# EAGLE design bq40z50 (EAGLE 9.4.2)
CNAME: CLEVO N85x Fuel Gauge Board; CREVISION: V1; DESIGNER: µgurkrcl
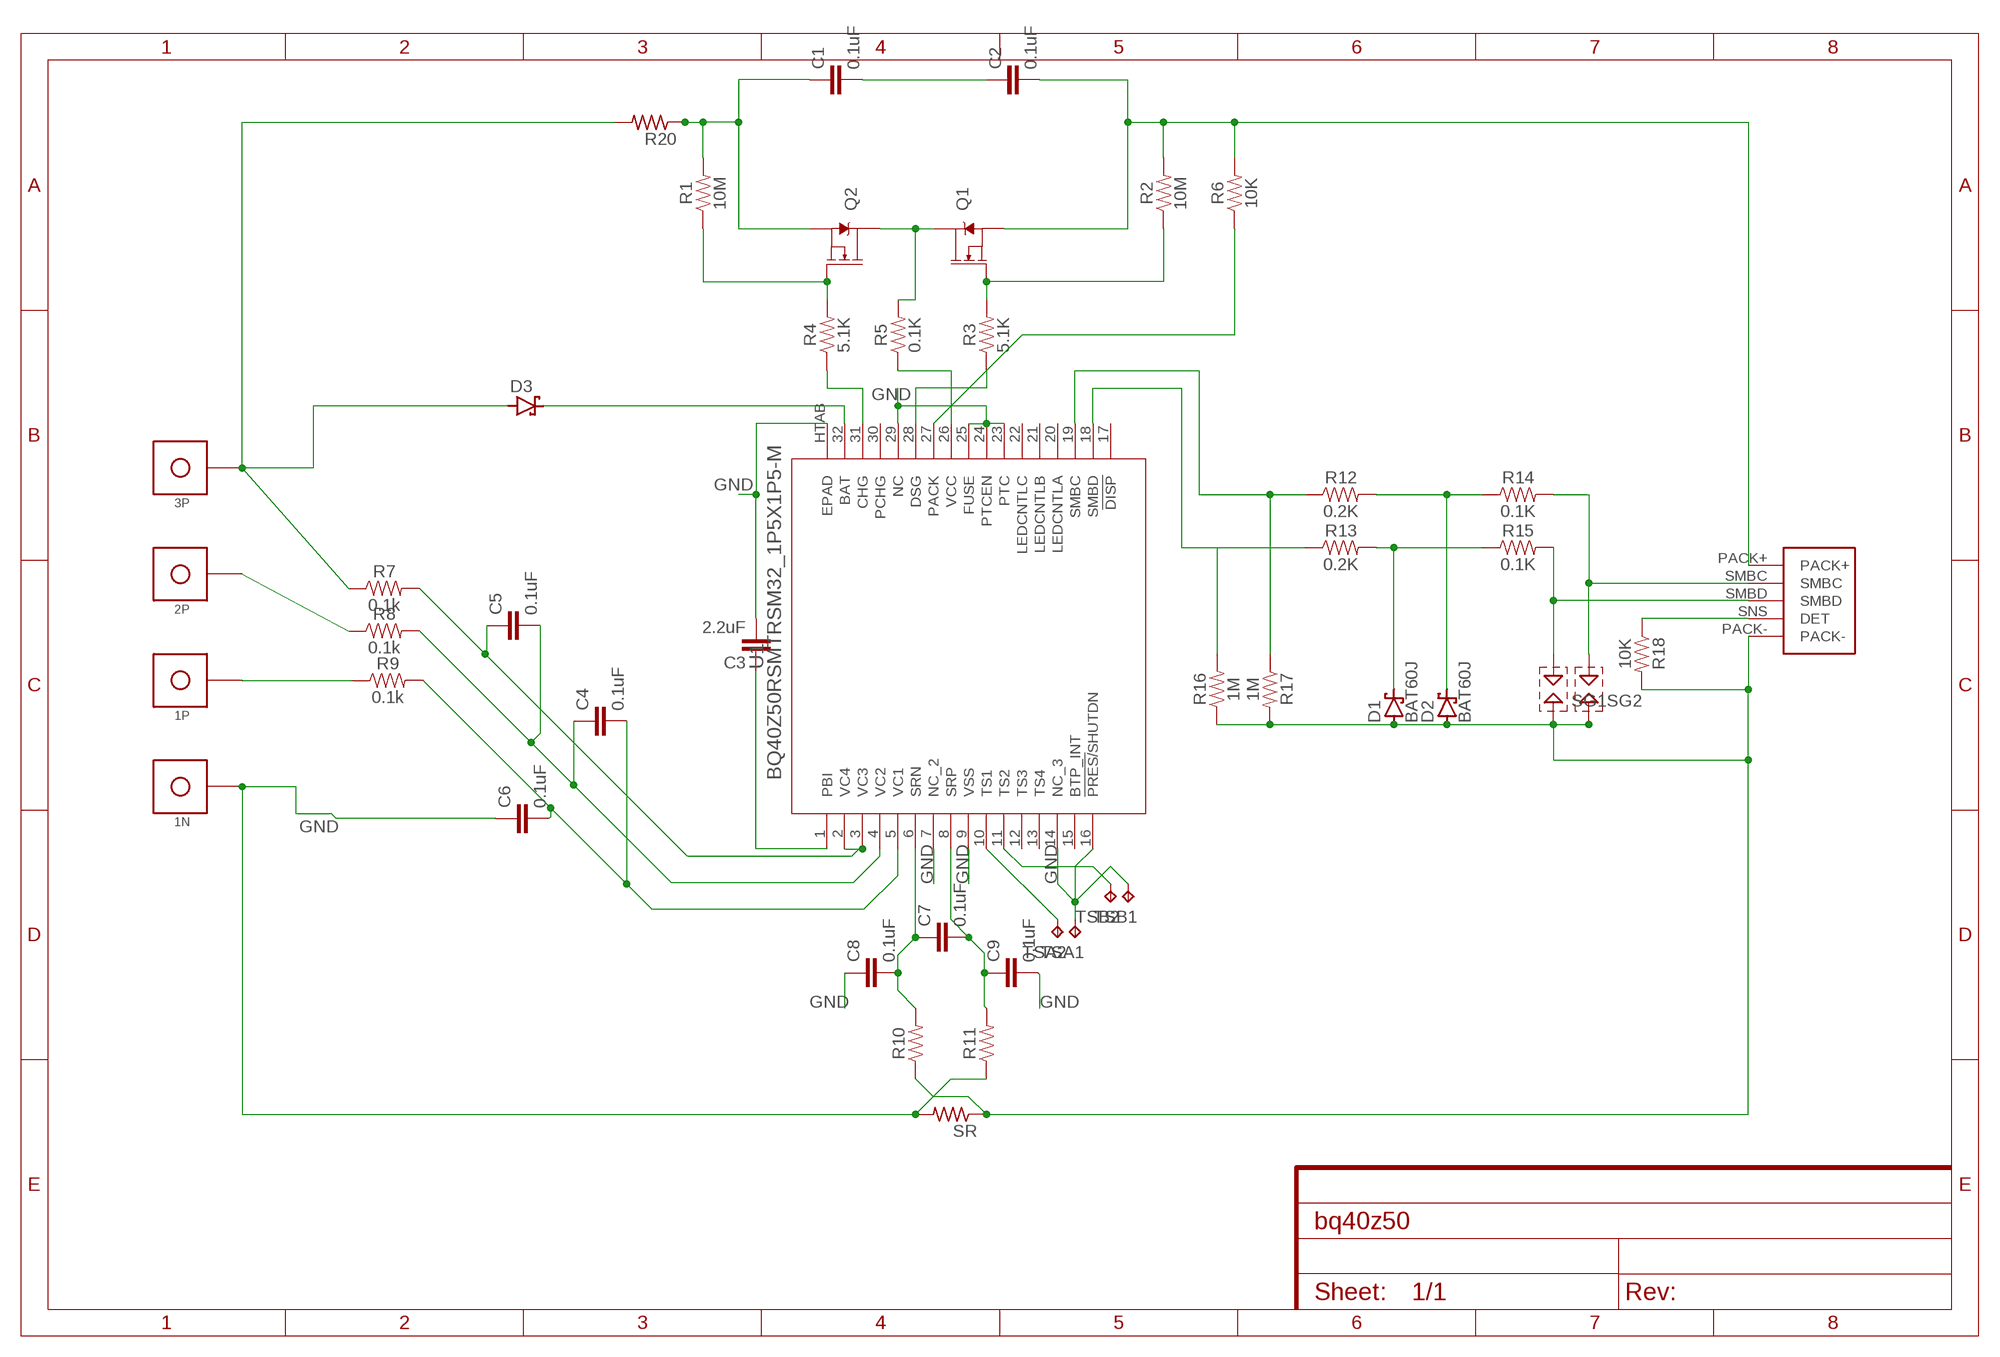
[diagram p0: schematic, sheet 1]

## Parts
1N  BAT_TAB  [BATT_TAB]
1P  BAT_TAB  [BATT_TAB]
2P  BAT_TAB  [BATT_TAB]
3P  BAT_TAB  [BATT_TAB]
C1  0.1uF  0.1UF-0402-16V-10%  [0402]
C2  0.1uF  0.1UF-0402-16V-10%  [0402]
C3  2.2uF  0.1UF-0402-16V-10%  [0402]
C4  0.1uF  0.1UF-0402-16V-10%  [0402]
C5  0.1uF  0.1UF-0402-16V-10%  [0402]
C6  0.1uF  0.1UF-0402-16V-10%  [0402]
C7  0.1uF  0.1UF-0402-16V-10%  [0402]
C8  0.1uF  0.1UF-0402-16V-10%  [0402]
C9  0.1uF  0.1UF-0402-16V-10%  [0402]
D1  BAT60J  [SOD323_ST]
D2  BAT60J  [SOD323_ST]
D3  BAT60J  [SOD323_ST]
Q1  6.5A/30V/38mΩ  MOSFET-NCH-FDS6630A  [SO08]
Q2  6.5A/30V/38mΩ  MOSFET-NCH-FDS6630A  [SO08]
R1  10M  RESISTOR0402  [0402]
R2  10M  RESISTOR0402  [0402]
R3  5.1K  RESISTOR0402  [0402]
R4  5.1K  RESISTOR0402  [0402]
R5  0.1K  RESISTOR0402  [0402]
R6  10K  RESISTOR0402  [0402]
R7  0.1k  RESISTOR0402  [0402]
R8  0.1k  RESISTOR0402  [0402]
R9  0.1k  RESISTOR0402  [0402]
R10  RESISTOR0402  [0402]
R11  RESISTOR0402  [0402]
R12  0.2K  RESISTOR0402  [0402]
R13  0.2K  RESISTOR0402  [0402]
R14  0.1K  RESISTOR0402  [0402]
R15  0.1K  RESISTOR0402  [0402]
R16  1M  RESISTOR0402  [0402]
R17  1M  RESISTOR0402  [0402]
R18  10K  RESISTOR0402  [0402]
R20  R-US_R2512  [R2512]
SG1  SPARK-GAP-8  [SPARK-GAP-8]
SG2  SPARK-GAP-8  [SPARK-GAP-8]
SR  R-US_R2512  [R2512]
TSA1  TPTP18R  [TP18R]
TSA2  TPTP18R  [TP18R]
TSB1  TPTP18R  [TP18R]
TSB2  TPTP18R  [TP18R]
U1  BQ40Z50RSMTRSM32_1P5X1P5-M  [RSM32_1P5X1P5-M]
U$1  N857HK1_FG  [N850BAT]

## Nets
GND: 1N.P$1 C3.2 C6.1 C8.1 C9.2 R11.1 SR.2 TSA1.TP TSB1.TP U1.7(NC_2) U1.9(VSS) U1.14(NC_3) U1.16(!PRES/!SHUTDN) U1.23(PTC) U1.24(PTCEN) U1.25(FUSE) U1.29(NC) U1.HTAB(EPAD)
N$1: Q2.4(G) R1.1 R4.2
N$2: 3P.P$1 D3.A R7.1 R20.2
N$3: D1.A D2.A R10.1 R16.1 R17.2 R18.2 SG1.2 SG2.2 SR.1 U$1.PACK-
N$4: C1.1 Q2.1(S) Q2.2(S) Q2.3(S) R1.2 R20.1
N$5: C1.2 C2.1
N$6: C2.2 Q1.1(S) Q1.2(S) Q1.3(S) R2.2 R6.2 U$1.PACK+
N$7: Q1.5(D) Q1.6(D) Q1.7(D) Q1.8(D) Q2.5(D) Q2.6(D) Q2.7(D) Q2.8(D) R5.2
N$8: Q1.4(G) R2.1 R3.2
N$9: R4.1 U1.31(CHG)
N$10: R3.1 U1.28(DSG)
N$11: R5.1 U1.26(VCC)
N$12: R6.1 U1.27(PACK)
N$13: D3.C U1.32(BAT)
N$14: C3.1 U1.1(PBI)
N$15: C5.1 R7.2 U1.2(VC4) U1.3(VC3)
N$16: 2P.P$1 R8.1
N$17: 1P.P$1 R9.1
N$18: C7.2 C9.1 R11.2 U1.8(SRP)
N$19: C4.1 C5.2 R8.2 U1.4(VC2)
N$20: C4.2 C6.2 R9.2 U1.5(VC1)
N$21: C7.1 C8.2 R10.2 U1.6(SRN)
N$22: TSA2.TP U1.10(TS1)
N$23: TSB2.TP U1.11(TS2)
N$24: R13.1 R16.2 U1.18(SMBD)
N$25: R12.1 R17.1 U1.19(SMBC)
N$26: D1.C R13.2 R15.1
N$27: D2.C R12.2 R14.1
N$28: R15.2 SG1.1 U$1.SMBD
N$29: R14.2 SG2.1 U$1.SMBC
N$30: R18.1 U$1.SNS(DET)
Unconnected: U1.12(TS3) U1.13(TS4) U1.15(BTP_INT) U1.17(!DISP) U1.20(LEDCNTLA) U1.21(LEDCNTLB) U1.22(LEDCNTLC) U1.30(PCHG)

## Library data of the parts
1N 1P 2P 3P = ugurkrcl:BAT_TAB
C1 C2 C4-C9 = SparkFun-Capacitors:0.1UF: 0.1µF ceramic capacitors A capacitor is a passive two-terminal electrical component used to store electrical energy temporarily in an electric field.; PROD_ID: CAP-12416
C3 = SparkFun-Capacitors:0.1UF: 0.1µF ceramic capacitors A capacitor is a passive two-terminal electrical component used to store electrical energy temporarily in an electric field.; PROD_ID: CAP-12416; VALUE: 0.1uF
D1-D3 = diode:BAT60J: Schottky barrier diode Source: www.st.com, BAT60J.pdf
Q1 Q2 = SparkFun-DiscreteSemi:MOSFET-NCH: N-channel MOSFETs Voltage controlled devices that allow control of high current outputs. SparkFun Products: SparkFun OpenScale <https://www.sparkfun.com/products/13261> SparkFun Digital Sandbox <https://www.sparkfun.com/products/12651> SparkFun Monster Moto Shield <https://www.sparkfun.com/products/10182> SparkFun MOSFET Power Controller <https://www.sparkfun.com/products/11214>; PROD_ID: TRANS-08089
R1-R18 = SparkFun-Resistors:RESISTOR: Generic Resistor Package
R20 SR = resistor:R-US_: RESISTOR, American symbol
SG1 SG2 = supressor:SPARK-GAP-: SPARK GAP
TSA1 TSA2 TSB1 TSB2 = testpad:TP: Test pad
U1 = Fuel Gauge:BQ40Z50RSMT; MANUFACTURER_PART_NUMBER: BQ40Z50RSMT; VENDOR: Texas Instruments
U$1 = ugurkrcl:N857HK1_FG

## Board
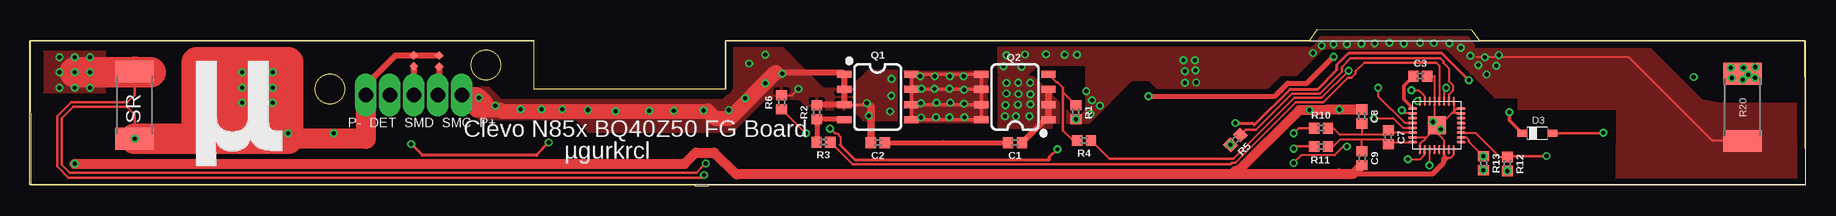
[diagram p1: board, top side]
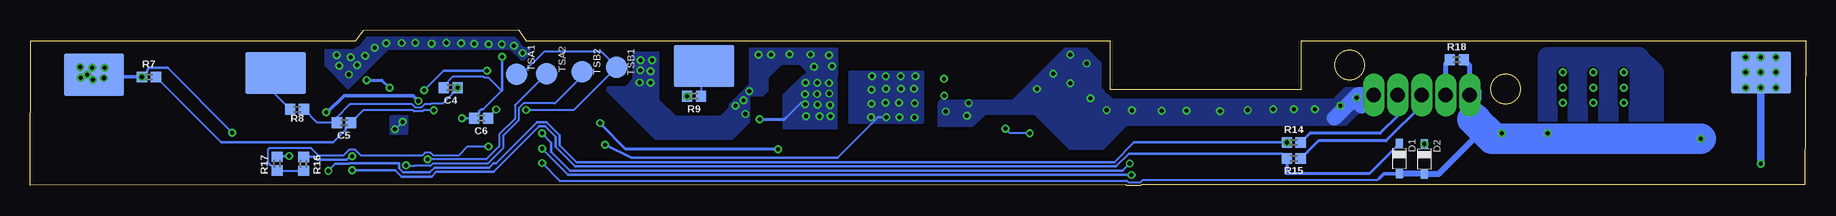
[diagram p2: board, bottom side, seen from below]

Size 148.01 x 12.98 mm. Coordinates in mm from the lower left corner, seen from the top.
Outline: 0.07,0.06 55.35,0.07 55.45,0 56.58,0 56.65,0.07 148.01,0.05 147.95,12.09 120.86,12.07 120.18,12.98 107.27,12.98 106.66,12.08 57.98,12.06 57.98,8.05 42.01,8.05 42.01,12.08 0,12.08 0.07,0.06
Outline: circle at 24.99,8.05 radius 1.24
Outline: circle at 37.99,10.06 radius 1.24
Copper layers (1*16): Top 0.035mm / dielectric 1.6mm / Bottom 0.035mm
Design rules "Elecrow_2-layer_PCB_eagle_rule": minimum track width 6mil, minimum drill 12mil, track to track 6mil, track to pad 8mil, pad to pad 12mil, via to via 12mil, smd to smd 0mil, copper to edge 20mil, drill to drill 10mil, minimum pad ring 6mil, minimum via ring 6mil, stop-mask expansion 0mil, vias tented up to drill 100mil, thermal gap 10mil

### Footprints (pad centres in the part's own frame; a part is rotated, then mirrored left to right if it is on the bottom)
BATT_TAB = smd 5 x 3.5: P$1 0,0
0402 = smd 0.85 x 0.9: 1 -0.58,0; 2 0.58,0
SOD323_ST = smd 0.8 x 0.6: A 1.25,0; C -1.25,0
SO08 = smd 0.6 x 1.2: 1 -1.905,-2.8; 2 -0.635,-2.8; 3 0.635,-2.8; 4 1.905,-2.8; 5 1.905,2.8; 6 0.635,2.8; 7 -0.635,2.8; 8 -1.905,2.8
R2512 = smd 1.8 x 3.2: 1 -2.8,0; 2 2.8,0
SPARK-GAP-8 = smd 0.508 x 0.508 rotated 45: 1 -0.457,0; 2 0.457,0
TP18R = smd 1.8 x 1.8: TP 0,0
RSM32_1P5X1P5-M = smd 0.2 x 0.75: 1 1.4,2.019; 2 1,2.019; 3 0.6,2.019; 4 0.2,2.019; 5 -0.2,2.019; 6 -0.6,2.019; 7 -1,2.019; 8 -1.4,2.019; 17 -1.4,-2.019; 18 -1,-2.019; 19 -0.6,-2.019; 20 -0.2,-2.019; 21 0.2,-2.019; 22 0.6,-2.019; 23 1,-2.019; 24 1.4,-2.019 | smd 0.75 x 0.2: 9 -2.019,1.4; 10 -2.019,1; 11 -2.019,0.6; 12 -2.019,0.2; 13 -2.019,-0.2; 14 -2.019,-0.6; 15 -2.019,-1; 16 -2.019,-1.4; 25 2.019,-1.4; 26 2.019,-1; 27 2.019,-0.6; 28 2.019,-0.2; 29 2.019,0.2; 30 2.019,0.6; 31 2.019,1; 32 2.019,1.4 | smd 1.5 x 1.5: HTAB 0,0
N850BAT = drill 1.2 pad 1.65 long: PACK+ 36.006,7.127; PACK- 28.006,7.127; SMBC 34.006,7.127; SMBD 32.006,7.127; SNS 30.006,7.127

### Placement (x,y rotation side)
1N  3.73,9.45 0 bottom
1P  91.82,9.97 0 bottom
2P  127.53,9.39 180 bottom
3P  142.68,9.25 0 bottom
C1  82.1,3.58 180 top
C2  70.67,3.58 180 top
C3  115.88,9.12 0 top
C4  112.95,8.18 180 bottom
C5  121.84,5.26 180 bottom
C6  110.41,5.64 180 bottom
C7  113.23,4.04 270 top
C8  111.02,5.77 270 top
C9  111.03,2.29 270 top
D1  33.85,2.25 270 bottom
D2  31.77,2.23 270 bottom
D3  125.65,4.37 0 top
Q1  70.67,7.39 270 top
Q2  82.1,7.39 90 top
R1  87.18,6.12 270 top
R2  65.59,6.12 90 top
R3  66.14,3.64 180 top
R4  87.87,3.77 180 top
R5  100.48,3.82 225 top
R6  62.66,6.95 90 top
R7  138.09,9.06 0 bottom
R8  125.75,6.36 0 bottom
R9  92.65,7.46 180 bottom
R10  107.62,4.8 0 top
R11  107.62,3.27 0 top
R12  123.13,1.82 270 top
R13  121.15,1.87 270 top
R14  42.66,3.61 0 bottom
R15  42.66,2.27 0 bottom
R16  125.21,1.82 90 bottom
R17  127.41,1.84 270 bottom
R18  29.08,10.5 0 bottom
R20  142.75,6.54 90 top
SG1  32,10.41 90 top
SG2  34.11,10.39 90 top
SR  8.72,6.71 90 top
TSA1  107.43,9.28 0 bottom
TSA2  104.96,9.35 0 bottom
TSB1  99.09,9.89 0 bottom
TSB2  101.99,9.5 0 bottom
U1  117.27,5.03 90 top
U$1  -0.01,0.45 0 top

### Tracks (layer width: path | path; a pad name or v marks a point on that pad's centre or on a via)
GND  (via drill 0.35)
  Top 0.152: v5,9.45 5,9.51 SR.2 | 117.27,4.89 116.4,4.03 | 116.4,4.03 116.09,3.71 116.07,3.71 115.87,3.51 U1.9 | U1.14 117.85,2.99 117.85,2.38 | 117.85,2.22 117.85,2.38 | 109.14,1.01 110.41,1.01 | 117.27,4.78 117.27,4.41 117.89,3.79 117.89,2.56 118.1,2.35 | 118.65,2.56 118.65,2.99 U1.16 118.67,2.58 118.44,2.35 118.27,2.35 | U1.23 118.52,6.03 | 118.52,6.03 117.42,4.93 | U1.24 118.92,6.43 118.67,6.18 | 117.42,4.93 117.27,4.78 | U1.29 117.07,5.29 117.27,5.09 | 117.27,5.09 117.42,4.93 | U1.7 116.4,4.03 | 118.27,2.35 118.1,2.35 | 117.85,1.93 117.89,1.97 | 117.89,1.97 118.27,2.35 | 118.1,2.35 118.06,2.35 | 118.06,2.35 117.88,2.35 117.85,2.38 | 117.89,1.97 117.89,2.18 118.06,2.35 | v117.59,4.71 U1.HTAB | U1.HTAB 117.27,5.09 | 117.27,4.89 117.27,4.78 | U1.HTAB 117.27,4.89 | U1.25 118.67,6.18 | 118.67,6.18 118.52,6.03 | 55.8,0.68 55.98,0.68
  Top 0.165: C3.2 117.07,9.13 U1.29
  Top 0.203: SR.2 8.72,7.55 8.11,6.94 3.43,6.94 2.28,5.79 2.28,1.61 3.21,0.68 4.34,0.68 55.8,0.68 | 55.98,0.68 v56.19,0.9 | v105.33,3.1 105.51,3.27 R11.1
  Top 0.406: 117.85,2.22 117.85,1.93 116.93,1.01 110.41,1.01
  Top 0.813: v3.73,1.83 54.56,1.83 55.5,2.76 57.04,2.76 58.79,1.01 | 58.79,1.01 58.82,0.98 58.98,0.98 | 58.79,1.01 100.25,1.01 | 100.25,1.01 109.14,1.01 110.33,1.01 C9.2 | 100.25,1.01 100.48,1.24 100.74,1.24 105.81,6.31 v106.64,6.31 108.07,6.31 108.11,6.35 v109.14,6.35 C8.1
  Top 2.54: v5,9.45 10.08,9.45 | SR.2 8.72,9.45 1N.P$1
  Bottom 0.152: 1N.P$1 v3.73,10.72 v2.46,10.72 | v106.64,6.31 102.67,6.31 TSB1.TP 100.36,11.16 105.17,11.16 107.05,9.28 TSA1.TP | v116.94,5.32 117.55,4.71 v117.59,4.71
  Bottom 0.203: v56.19,0.9 103.13,0.9 v105.33,3.1 | C6.1 109.83,5.66 v109.14,6.35
  Bottom 0.61: 1N.P$1 v3.73,1.83
  other vias: 3.73,9.45 5,10.72 2.46,9.45 2.46,8.18 3.73,8.18 5,8.18
  pour Top: 1.19,11.23 6.27,11.23 6.27,7.7 1.19,7.7
  pour Bottom (no thermals): 116.51,5.77 117.96,5.77 117.97,5.76 117.97,4.34 117.96,4.34 116.56,4.34 116.56,4.34 116.51,4.39
N$1
  Top 0.203: Q2.4 85.57,8.63 85.63,8.63 86.11,8.15 | 86.11,8.15 86.11,4.6 86.94,3.77 R4.2 | R1.1 86.11,7.77 86.11,8.15
N$2  (via drill 0.35)
  Top 0.152: R20.2 142.83,9.41 v142.83,9.84 | R20.2 142.64,9.45 142.16,9.45 v141.77,9.83 | R20.2 142.2,9.34 v141.85,8.98 | R20.2 v142.75,8.84 v142.76,8.83 | v143.79,8.99 143.44,9.34 143.26,9.34 | 143.26,9.34 v143.82,9.89 | R20.2 143.26,9.34 | R20.2 143.15,9.34 v143.24,9.25
  Top 0.203: D3.A 131.1,4.37 v131.15,4.42
  Bottom 0.203: 138.7,9.06 138.24,9.51 138.24,9.64 138.07,9.82 136.55,9.82 v131.15,4.42
  Bottom 0.305: R7.1 138.7,9.06 143.04,9.06 v143.24,9.25 | 143.43,9.45 v143.24,9.25 | v143.24,9.25 3P.P$1
  other vias: 138.67,9.06
N$3  (via drill 0.35)
  Top 0.152: v109.77,3.27 109.47,3.27 108.74,2.54 | 108.73,2.54 108.74,2.54 | v105.33,1.9 105.98,2.54 108.74,2.54
  Top 0.203: SR.1 8.72,5.91 8.04,6.59 3.61,6.59 2.66,5.64 2.66,1.74 3.31,1.08 55.56,1.08 55.95,1.48 55.96,1.48 v56.34,1.86 | v105.33,4.37 105.76,4.8 R10.1
  Top 0.508: U$1.PACK- 28.64,8.22 28.64,9.04 30.48,10.87 SG1.2 34.08,10.87 SG2.2
  Top 1.651: U$1.PACK- 28,3.91 SR.1 | 17.7,3.92 15.16,3.92 v15.16,6.91 v15.16,8.18 v15.16,9.45 v17.7,9.45 v20.24,9.45 v20.24,8.18 v20.24,6.91 20.24,5.64 16.43,5.64 16.43,8.18 v17.7,8.18 18.97,8.18 18.97,6.91 v17.7,6.91
  Top 2.54: SR.1 13.89,3.91 13.89,10.3 21.51,10.3 v21.51,4.37 21.51,3.92 17.7,3.92 SR.1
  Bottom 0.152: R16.1 125.23,1.26 R17.2 127.86,1.72 127.97,1.72 128.19,1.94 128.19,3.01 128.07,3.13 124.55,3.13 123.92,2.5 121.9,2.5 121.38,3.01 120.92,3.01 120.41,2.5 115.34,2.5 115.08,2.76 114.62,2.76 114.36,2.5 112.29,2.5 111.52,3.27 v109.77,3.27 | v105.33,1.9 103.86,0.43 56.58,0.43 56.43,0.28 55.45,0.28 55.25,0.49 35.69,0.49 35.55,0.63 | 33.55,0.98 33.83,0.98
  Bottom 0.203: v56.34,1.86 56.93,1.27 56.93,1.26 102.99,1.26 104.56,2.83 104.56,3.6 v105.33,4.37 | 27.77,5.55
  Bottom 0.254: 28,8.45 27.63,8.45 27.11,7.93 27.11,7.2 27.64,6.68 | 27.86,6.31 27.86,6.46 27.64,6.68 | U$1.PACK- 28,7.05 27.64,6.68
  Bottom 0.305: 35.55,0.63 35.16,1.01 33.55,0.98
  Bottom 0.406: U$1.PACK- 28,8.45 28,10.01 R18.2
  Bottom 0.508: 33.55,0.98 D2.A 30.57,0.98 27.18,4.37 v25.32,4.37 | 33.83,0.98 D1.A
  Bottom 1.016: 24.86,3.91 v25.32,4.37 27.26,6.31 27.86,6.31
  Bottom 1.651: U$1.PACK- 28,6.6 27.86,6.46
  Bottom 2.54: SR.1 24.86,3.91 26.13,3.91 27.77,5.55 | 27.77,5.55 27.48,5.55
  other vias: 8.72,3.91
N$4  (via drill 0.35)
  Top 0.152: R20.1 140.25,3.74 133.27,10.72 120.57,10.72
  Top 0.406: 84.87,5.77 C1.1
  Top 0.508: 84.87,5.77 84.87,8 Q2.3 Q2.1 84.58,5.49 C1.1
  Bottom 0.203: 85.01,5.64 83.74,6.91 83.51,6.91 v83.39,6.79
  Bottom 0.254: R1.2 85.1,5.54 85.01,5.64
  other vias: 81.41,8.56 82.38,8.59 83.37,8.58 83.4,7.63 82.4,7.65 81.38,7.69 81.32,6.72 82.35,6.76 83.31,5.8 82.18,5.78 81.28,5.78 87.18,5.54 106.93,11.06 107.66,11.66 108.67,11.79 109.78,11.8 110.98,11.84 112.08,11.87 113.3,11.93 114.53,11.85 115.88,11.92 117.02,11.89 118.31,11.87 119.27,11.5 120.06,10.84 120.73,10.05 121.42,9.27 122.23,10 122.44,10.89 121.27,10.72 81.15,9.95 82.66,9.91 81.39,10.88 82.93,10.93 84.7,10.96 86.24,10.91 87.28,10.92 88.04,7.87 88.53,7.13 88.39,5.98 89.2,6.66 96.14,10.47 97.1,10.46 96.28,9.53 96.27,8.58 97.14,9.61 97.2,8.61
  pour Top (no thermals): 85.12,8.06 85.12,4.82 80.8,4.82 80.8,9.1 83.46,9.1 84.5,8.06 85.12,8.06
  pour Bottom (no thermals): 83.48,9.22 85.17,7.52 85.17,4.81 80.77,4.81 80.76,4.81 80.76,9.11 80.78,9.13 83.4,9.13 83.47,9.21
  pour Top (no thermals): 140.89,6.91 147.24,6.91 147.26,0.6 132.25,0.62 132.28,6.31 124.07,6.31 124.07,7.29 122.13,7.29 117.97,11.45 135.05,11.45 139.31,7.2
  pour Top (no thermals): 120.37,10.68 118.84,10.68 118.11,11.41 107.76,11.41 105.55,9.19 104.23,9.19 103.16,8.13 93.96,8.13 93.31,8.78 91.83,8.78 88.25,5.2 82.23,5.2 82.22,5.21 82.22,9.06 82.2,9.08 83.65,9.08 86.81,5.91 87.61,5.91 88.08,6.38 88.08,10.02 83.97,10.02 83.21,9.26 80.86,9.26 80.72,9.4 80.72,11.82 80.73,11.83 106.74,11.83 107.42,12.51 119.95,12.51 120.37,12.09
  pour Bottom (no thermals): 106.4,11.52 106.4,10.96 106.87,10.49 107.05,10.49 107.95,11.39 118.2,11.39 121.49,8.1 123.37,9.98 123.37,11.34 120.94,11.34 119.92,12.37 107.67,12.37 106.83,11.54 106.43,11.54 106.42,11.55
  pour Bottom (no thermals): 80.7,9.13 80.7,11.49 87.98,11.49 88.02,11.44 88.02,8.46 88.88,7.6 89.68,6.8 89.68,6.53 88.29,5.15 88.2,5.15 88.03,5.32 88.03,7.44 87.92,7.56 86.89,7.56 86.49,7.96 86.49,9.04 85.37,10.16 83.87,10.16 83.29,9.58 83.29,9.16 80.7,9.16 80.7,9.15
  pour Bottom (no thermals): 95.63,11.09 95.63,7.18 94.25,5.8 90.39,5.8 89.66,6.53 88.26,5.14 88.26,5.1 89.48,3.88 95.85,3.88 99.81,7.84 99.81,8.21 99.75,8.27 98.33,8.27 97.7,8.9 97.7,11.07 97.65,11.13 95.65,11.13
N$5
  Top 0.406: C2.1 76.12,3.58 C1.2
N$6  (via drill 0.35)
  Top 0.152: R6.2 63.54,7.53 v64.06,8.06
  Top 0.254: Q1.3 69.62,6.76 69.77,6.91 70.09,6.59
  Top 0.508: 62.15,9.45 67.72,9.45 Q1.1 Q1.3 65.64,6.76 R2.2
  Top 0.61: C2.2 70.09,6.59
  Top 1.27: 38.02,6.91 37.35,7.58 U$1.PACK+ 37.2,6.38 37.2,6.31 39.16,6.31 39.26,6.22 56.49,6.22 57.07,5.64 58.34,5.64 62.15,9.45
  Bottom 1.27: U$1.PACK+ 37.35,7.58 37.38,7.55 | 39.29,5.64 37.38,7.55 | 37.38,7.55 37.38,7.58 | 37.02,6.63 37.38,6.99 37.38,7.55
  other vias: 38.79,6.66 42.65,6.38 37.42,7.34 40.9,6.36 44.38,6.36 46.5,6.31 61.3,10.92 59.93,10.19 62.71,9.33 61.3,8.54 59.61,7.3 58.25,6.31 56.16,6.28 53.67,6.26 51.62,6.26 48.81,6.22 71.81,8.9 71.8,7.49 71.68,6.19 69.76,6.89 69.92,5.84
  pour Top: 72.27,5.47 72.27,9.54 72.22,9.59 69.84,9.59 68.33,8.08 66.15,8.08 65.11,9.11 62.64,11.58 58.69,11.58 58.69,8.07 57.73,7.12 39.32,7.12 37.94,8.5 37.13,7.7 37.13,5.87 37.45,5.56 45.54,5.56 46.58,4.52 46.92,4.52 58.55,4.52 61.3,7.27 64.09,7.27 64.99,6.36 68.57,6.36 69.48,5.45 72.25,5.45
  pour Bottom: 36.74,8.17 38.38,8.17 39.37,7.19 57.73,7.19 58.7,8.16 58.7,10.22 60.1,11.62 61.6,11.62 66.11,7.11 72.14,7.11 72.35,6.89 72.35,4.97 69.38,4.97 68.38,5.97 64.28,5.97 61.35,3.04 58.54,3.04 56.55,5.03 38.26,5.03 36.45,6.84 36.45,8.46
N$7  (via drill 0.35)
  Top 0.152: 79.3,5.64 Q2.8
  Top 0.203: R5.2
  Top 0.305: 73.47,8.18 Q1.8 Q2.5 79.3,6.91 | 73.47,8.18 Q1.5 Q2.8 | 79.3,6.91 79.3,5.64 | Q2.6 73.62,8.03 73.47,8.18 | Q1.6 79.15,6.76 79.3,6.91
  Bottom 0.203: v76.63,5.71 77.31,5.71 80.7,2.32 97.85,2.32 R5.2
  other vias: 74.21,9.13 75.42,9.12 76.67,9.11 77.83,9.13 77.87,8.01 77.87,6.84 77.9,5.7 75.52,5.7 74.28,5.69 74.26,6.89 75.57,6.93 76.7,6.91 76.64,8.08 75.39,8.07 74.31,8.09 100.07,3.41
  pour Top (no thermals): 73.58,9.45 78.66,9.45 79.67,9.45 79.67,5.32 73.58,5.32
  pour Bottom (no thermals): 73.58,9.45 79.66,9.45 79.66,5.28 73.59,5.28 73.59,9.44 73.58,9.44
N$8
  Top 0.406: Q1.4 67.81,5.54 R2.1 65.59,3.67 R3.2
N$9  (via drill 0.35)
  Top 0.152: U1.31 116.25,7.07 116.25,7.49 115.78,7.95 v115.15,7.95
  Top 0.203: R4.1 89.97,2.25 100.32,2.25 105.39,7.32 107.65,7.32 v109.92,9.59
  Bottom 0.203: v109.92,9.59 113.51,9.59 v115.15,7.95
N$10
  Top 0.152: U1.28 | 117.47,10.01 U1.28
  Top 0.203: R3.1 68.55,1.8 100.11,1.8 100.2,1.9 100.47,1.9 105.53,6.97 107.79,6.97 109.84,9.01 110.16,9.01 110.5,9.35 110.5,9.54 111.23,10.26 117.21,10.26 117.47,10.01
N$11
  Top 0.152: 117.8,10.25 118.27,9.78 118.27,8.72 118.59,8.39 118.59,7.93 118.27,7.6 U1.26
  Top 0.203: R5.1 101.31,4.66 102.18,4.66 105.2,7.68 107.5,7.68 109.34,9.51 109.34,9.89 110.07,10.62 117.57,10.62 117.8,10.39 117.8,10.25
N$12  (via drill 0.35)
  Top 0.152: R6.1 64.65,4.38 v64.68,4.38 | v66.69,4.76 67.09,4.36 67.26,4.36 67.57,4.05 67.57,3.4 | v118.04,8.16 117.87,7.99 U1.27
  Top 0.254: 67.57,3.4 67.54,3.4 68.76,2.18 85,2.18 85,2.4 v85.65,3.04 | v100.49,5.22 101.89,5.22 102.05,5.06 105.05,8.06 107.34,8.06 108.95,9.67 108.95,10.09 109.9,11.04 117.71,11.04 v119.94,8.8
  Bottom 0.152: v64.68,4.38 66.31,4.38 v66.69,4.76
  Bottom 0.254: v85.65,3.04 98.34,3.04 100.32,5.02 100.32,5.05 v100.49,5.22 | v119.94,8.8 118.68,8.8 v118.04,8.16
N$13  (via drill 0.35)
  Top 0.152: U1.32 v115.65,7.05 v115.64,7.06
  Top 0.305: v123.31,6.13 123.31,5.45 D3.C
  Bottom 0.305: v123.31,6.13 123.22,6.13 121.84,7.5 116.08,7.5 v115.64,7.06
N$14
  Top 0.152: U1.1
  Top 0.203: 115.25,6.48 U1.1
  Top 0.305: C3.1 114.52,8.34 114.52,7.21 115.25,6.48
N$15  (via drill 0.35)
  Top 0.152: U1.3 U1.2 114.6,6.03 v114.34,6.29
  Bottom 0.152: 120.73,5.79 120.23,6.29 116.09,6.29 115.99,6.2 115.28,6.2 115.19,6.29 v114.34,6.29 | 120.73,5.79 120.77,5.75 | 120.73,5.79 C5.1
  Bottom 0.203: R7.2 132.08,3.63 122.74,3.63 121.69,4.68 121.69,4.83 C5.1
N$16
  Bottom 0.152: R8.1 127.53,7.56 2P.P$1
N$17
  Bottom 0.152: 1P.P$1 92.07,9.72 R9.1
N$18
  Top 0.152: U1.8 113.4,3.63 C7.2 112.86,3.83 111.03,3.83 | R11.2 108.63,3.27 109.18,3.83 111.03,3.83 | C9.1 111.03,3.83
N$19  (via drill 0.35)
  Top 0.152: U1.4 115.23,5.25 114.6,5.25 112.37,7.48 C4.1
  Bottom 0.152: R8.2 124.06,5.26 C5.2 122.42,5.71 121.34,6.78 116.15,6.78 115.87,6.5 115.41,6.5 115.25,6.66 115.12,6.78 114.63,6.78 114.57,6.84 113.59,6.84 112.83,7.61 112.83,7.72 C4.1
  other vias: 112.37,8.18
N$20  (via drill 0.35)
  Top 0.152: v112,5.64 113.64,5.64 114.45,4.83 U1.5
  Top 0.406: R9.2 103.77,7.46 104.85,8.54 106.45,8.54 v108.66,10.75
  Bottom 0.152: C4.2 113.53,8.31 112.72,9.12 110.23,9.12 110.15,9.04 109.83,9.04 108.71,7.92
  Bottom 0.203: v108.66,10.75 108.66,7.96 108.71,7.92 110.23,6.39 110.38,6.39 110.56,6.21 110.56,6.07 C6.2 v112,5.64
  other vias: 93.23,7.46
N$21
  Top 0.152: U1.6 113.42,4.43 C7.1 112.85,4.24 111.02,4.24 | 111.02,4.24 109.19,4.24 108.63,4.8 R10.2 | C8.2 111.02,4.24
N$22  (via drill 0.35)
  Top 0.152: U1.10 116.25,2.99 116.25,2.56 115.89,2.2 v114.85,2.2
  Bottom 0.152: TSA2.TP 107.58,6.73 107.58,5.58 108.89,4.28 108.89,3.29 109.98,2.2 114.49,2.2 v114.85,2.2
N$23  (via drill 0.35)
  Top 0.152: v116.64,1.69 116.67,1.72 U1.11
  Bottom 0.152: TSB2.TP 102.15,9.33 102.15,8.97 104.26,6.86 106.87,6.86 107.27,6.46 107.27,5.46 108.58,4.15 108.58,3.12 109.86,1.83 114.43,1.83 114.62,1.65 115.99,1.65 115.99,1.64 116.59,1.64 v116.64,1.69
N$24  (via drill 0.35)
  Top 0.152: R13.1 119.94,3.67 119.94,3.8 119.73,4.01 119.6,4.01 119.58,4.03
  Top 0.203: 119.58,4.03 U1.18 | R13.1
  Bottom 0.203: R13.1 121.21,2.4 121.37,2.4 121.6,2.17 124.06,2.17 124.29,2.4 R16.2
  other vias: 121.15,2.46
N$25  (via drill 0.35)
  Top 0.152: U1.19 119.31,4.41 120.47,4.41 122.48,2.4 R12.1
  Top 0.203: 123.14,2.72 R12.1 123.21,2.47 v126.41,2.47
  Bottom 0.203: R17.1 127.36,2.47 v126.41,2.47
N$26  (via drill 0.35)
  Bottom 0.203: R15.1 43.64,2.67 56.42,2.67 57.48,1.61 102.57,1.61 104.21,3.24 104.21,4.07 105.09,4.95 105.57,4.95 109.37,1.15 114.15,1.15 114.54,0.76 117.03,0.76 117.57,1.29 R13.2
  Bottom 0.254: R15.1 43.24,1.02 | 43.24,1.02 43.29,1.02 | 43.24,1.02 36.34,1.02 D1.C
  other vias: 121.15,1.29
N$27  (via drill 0.35)
  Top 0.254: R14.1 42.24,2.6 42.24,2.53 32.72,2.53 D2.C
  Bottom 0.203: R14.1 55.99,3.61 57.63,1.97 102.43,1.97 103.85,3.39 103.85,4.21 104.94,5.3 105.72,5.3 109.17,1.85 109.38,1.85 109.73,1.5 114.3,1.5 114.69,1.11 116.88,1.11 117.22,1.45 117.22,1.85 120.89,1.85 120.91,1.88 121.39,1.88 121.45,1.82 122.56,1.82 R12.2
  other vias: 123.13,1.24 43.24,3.61 31.77,3.48
N$28
  Top 0.508: SG1.1 U$1.SMBD
  Bottom 0.254: R15.2 41.53,2.83 41.52,2.83 41.33,3.02 41.33,3.03 40.62,3.74 34.98,3.74 32,6.72 U$1.SMBD
N$29
  Top 0.508: SG2.1 34.11,7.68 U$1.SMBC
  Bottom 0.254: R14.2 41.32,4.37 35.48,4.37 34,5.85 U$1.SMBC
N$30
  Bottom 0.406: U$1.SNS 30,10.16 R18.1
N$32
  pour Bottom: 12.62,4.37 12.62,9.45 13.89,10.72 21.51,10.72 21.51,4.37

### Text on the board
tNames: Clevo N85x BQ40Z50 FG Board | µgurkrcl